# EAGLE design arduino_helper (EAGLE 6.5.0)
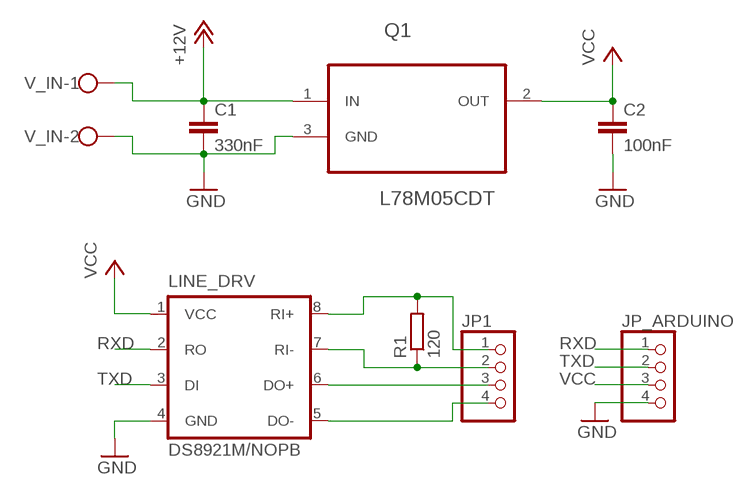
[diagram p0: schematic, sheet 1]

## Parts
C1  330nF  C-EUC0805  [C0805]
C2  100nF  C-EUC0805  [C0805]
JP1  PINHD-1X4  [1X04]
JP_ARDUINO  PINHD-1X4  [1X04]
LINE_DRV  DS8921M/NOPB  [SOIC8]
Q1  L78M05CDT  [TO225P972X240-3N]
R1  120  R-EU_R0805  [R0805]
V_IN  W237-102  [W237-102]

## Nets
+12V: C1.1 Q1.1(IN) V_IN.1
GND: C1.2 C2.2 JP_ARDUINO.4 LINE_DRV.4(GND) Q1.3(GND) V_IN.2
N$1: JP1.2 LINE_DRV.7(RI-) R1.1
N$2: JP1.1 LINE_DRV.8(RI+) R1.2
N$3: JP1.4 LINE_DRV.5(DO-)
N$4: JP1.3 LINE_DRV.6(DO+)
RXD: JP_ARDUINO.1 LINE_DRV.2(RO)
TXD: JP_ARDUINO.2 LINE_DRV.3(DI)
VCC: C2.1 JP_ARDUINO.3 LINE_DRV.1(VCC) Q1.2(OUT)

## Library data of the parts
C1 C2 = rcl:C-EU: CAPACITOR, European symbol
JP1 JP_ARDUINO = pinhead:PINHD-1X4: PIN HEADER
LINE_DRV = rvp:DS8921M/NOPB
Q1 = ST Microelctronics_By_element14_Batch_1:L78M05CDT: Positive voltage regulators; MPN: L78M05CDT; OC_FARNELL: 1087116; OC_NEWARK: 78K5325; PACKAGE: DPAK; SUPPLIER: STMICROELECTRONICS
R1 = resistor:R-EU_: RESISTOR, European symbol
V_IN = con-wago-500:W237-102: WAGO SCREW CLAMP; MPN: 237-102; OC_FARNELL: unknown; OC_NEWARK: 70K9898

## Board
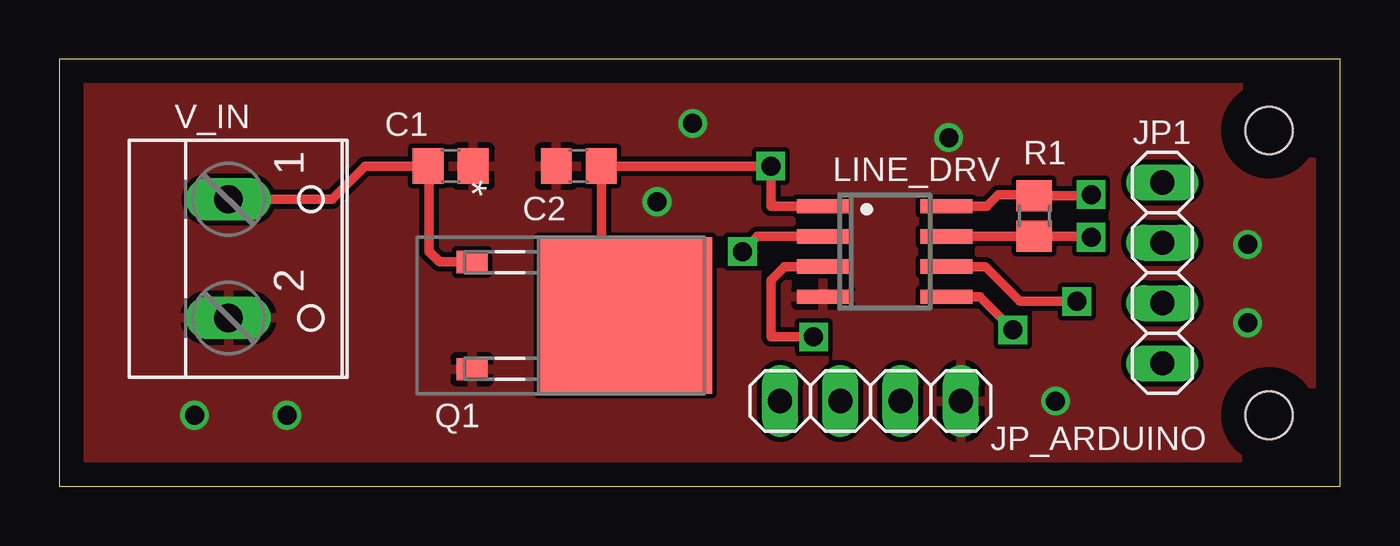
[diagram p1: board, top side]
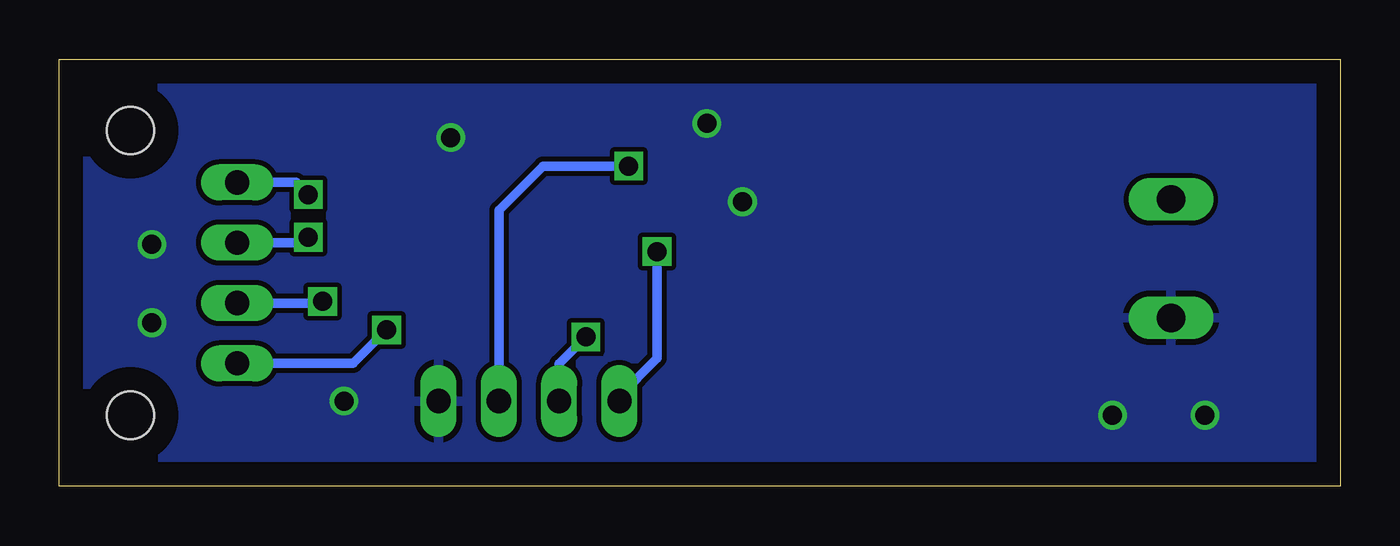
[diagram p2: board, bottom side, seen from below]

Size 54 x 18 mm. Coordinates in mm from the lower left corner, seen from the top.
Outline: 0,0 54,0 54,18 0,18 0,0
Copper layers (1*16): Top 0.035mm / dielectric 1.5mm / Bottom 0.035mm
Design rules "default": minimum track width 10mil, minimum drill 24mil, track to track 8mil, track to pad 8mil, pad to pad 8mil, via to via 8mil, smd to smd 8mil, copper to edge 40mil, drill to drill 8mil, minimum pad ring 10mil, minimum via ring 8mil, stop-mask expansion 4mil, vias tented up to drill 0mil, thermal gap 10mil
Holes 2 mm at 51,3 51,15

### Footprints (pad centres in the part's own frame; a part is rotated, then mirrored left to right if it is on the bottom)
C0805 = smd 1.3 x 1.5: 1 -0.95,0; 2 0.95,0
1X04 = drill 1.016 long: 1 -3.81,0; 2 -1.27,0; 3 1.27,0; 4 3.81,0
SOIC8 = smd 0.6 x 2.2: 1 -1.905,-2.6; 2 -0.635,-2.6; 3 0.635,-2.6; 4 1.905,-2.6; 5 1.905,2.6; 6 0.635,2.6; 7 -0.635,2.6; 8 -1.905,2.6
TO225P972X240-3N = smd 0.94 x 1.321: 1 -2.261,-6.299; 3 2.261,-6.299 | smd 6.604 x 7.315: 2 0,0.152
R0805 = smd 1.3 x 1.5: 1 -0.85,0; 2 0.85,0
W237-102 = drill 1.194 long: 1 -2.5,-1.27; 2 2.5,-1.27

### Placement (x,y rotation side)
C1  16.5,13.5 0 top
C2  21.9,13.5 180 top
JP1  46.5,9 270 top
JP_ARDUINO  34.2,3.6 0 top
LINE_DRV  34.8,9.9 270 top
Q1  23.7,7.2 270 top
R1  41.1,11.4 90 top
V_IN  8.4,9.6 270 top

### Tracks (layer width: path | path; a pad name or v marks a point on that pad's centre or on a via)
+12V
  Top 0.406: V_IN.1 11.5,12.1 12.9,13.5 C1.1 15.6,13.45 15.6,9.9 16.04,9.46 Q1.1
GND  (via drill 0.8)
  other vias: 5.7,3 9.6,3 42,3.6 50.1,6.9 50.1,10.2 37.5,14.7 26.7,15.3 25.2,12
  pour Bottom: 0,18 54,18 54,0 0,0
  pour Top: 0,18 54,18 54,0 0,0
N$1  (via drill 0.8)
  Top 0.406: v43.5,10.5 43.45,10.55 R1.1 37.41,10.55 LINE_DRV.7
  Bottom 0.406: JP1.2 43.73,10.27 v43.5,10.5
N$2  (via drill 0.8)
  Top 0.406: LINE_DRV.8 39.1,11.8 39.6,12.3 41.05,12.3 R1.2 43.45,12.25 v43.5,12.3
  Bottom 0.406: JP1.1 44.01,12.81 v43.5,12.3
N$3  (via drill 0.8)
  Top 0.406: LINE_DRV.5 38.8,8 v40.2,6.6
  Bottom 0.406: JP1.4 41.61,5.19 v40.2,6.6
N$4  (via drill 0.8)
  Top 0.406: LINE_DRV.6 39.03,9.27 40.5,7.8 v42.9,7.8
  Bottom 0.406: JP1.3 42.97,7.73 v42.9,7.8
RXD  (via drill 0.8)
  Top 0.406: LINE_DRV.2 29.43,10.54 v28.8,9.9
  Bottom 0.406: JP_ARDUINO.1 30.39,3.81 28.8,5.4 v28.8,9.9
TXD  (via drill 0.8)
  Top 0.406: LINE_DRV.3 30.57,9.27 30,8.7 30,6.3 v31.8,6.3
  Bottom 0.406: JP_ARDUINO.2 32.93,5.17 v31.8,6.3
VCC  (via drill 0.8)
  Top 0.406: Q1.2 22.85,8.2 C2.1 v30,13.5 30,11.8 LINE_DRV.1
  Bottom 0.406: JP_ARDUINO.3 35.47,11.63 33.6,13.5 v30,13.5